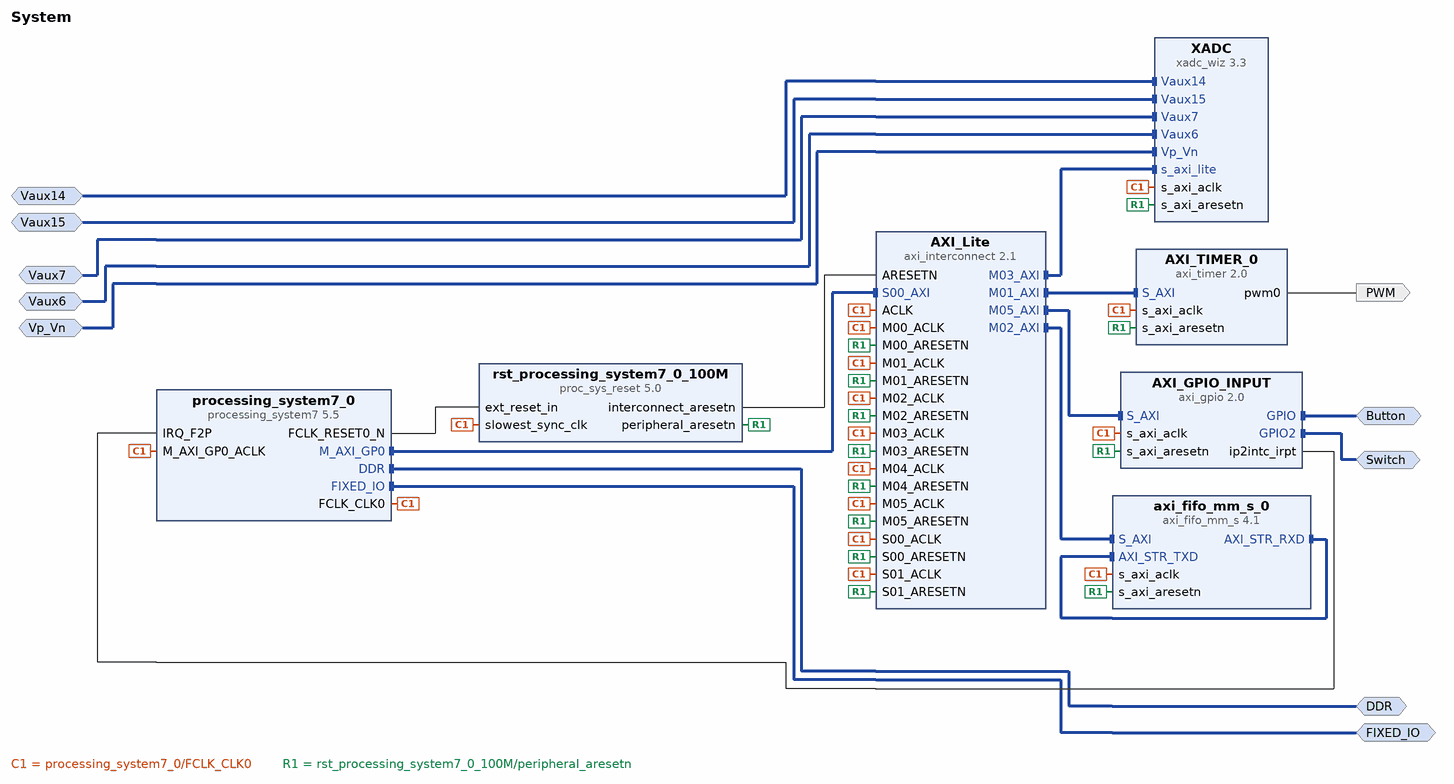
[diagram p0: block diagram of the top level]
# Vivado block design System, Vivado 2016.2
create_bd_design System

create_bd_intf_port -mode Master -vlnv xilinx.com:interface:ddrx_rtl:1.0 DDR
create_bd_intf_port -mode Master -vlnv xilinx.com:display_processing_system7:fixedio_rtl:1.0 FIXED_IO
create_bd_intf_port -mode Slave -vlnv xilinx.com:interface:diff_analog_io_rtl:1.0 Vaux14
create_bd_intf_port -mode Master -vlnv xilinx.com:interface:gpio_rtl:1.0 Button
create_bd_intf_port -mode Slave -vlnv xilinx.com:interface:diff_analog_io_rtl:1.0 Vaux15
create_bd_intf_port -mode Slave -vlnv xilinx.com:interface:diff_analog_io_rtl:1.0 Vaux7
create_bd_intf_port -mode Slave -vlnv xilinx.com:interface:diff_analog_io_rtl:1.0 Vaux6
create_bd_intf_port -mode Master -vlnv xilinx.com:interface:gpio_rtl:1.0 Switch
create_bd_intf_port -mode Slave -vlnv xilinx.com:interface:diff_analog_io_rtl:1.0 Vp_Vn
create_bd_port -dir O PWM

create_bd_cell -type ip -vlnv xilinx.com:ip:processing_system7:5.5 processing_system7_0
set_property -dict [list \
  CONFIG.PCW_UIPARAM_DDR_FREQ_MHZ 525 \
  CONFIG.PCW_CRYSTAL_PERIPHERAL_FREQMHZ 50.000000 \
  CONFIG.PCW_APU_PERIPHERAL_FREQMHZ 650 \
  CONFIG.PCW_SDIO_PERIPHERAL_FREQMHZ 50 \
  CONFIG.PCW_FPGA0_PERIPHERAL_FREQMHZ 100 \
  CONFIG.PCW_USE_FABRIC_INTERRUPT 1 \
  CONFIG.PCW_IRQ_F2P_INTR 1 \
  CONFIG.PCW_IMPORT_BOARD_PRESET /home/daniel/Dropbox/Hobby/Zybo_Xilinx_Xilibus/Zybo/Zybo.xml \
  CONFIG.PCW_PRESET_BANK1_VOLTAGE {LVCMOS 1.8V} \
  CONFIG.PCW_UIPARAM_DDR_PARTNO {MT41K128M16 JT-125} \
  CONFIG.PCW_QSPI_PERIPHERAL_ENABLE 1 \
  CONFIG.PCW_QSPI_GRP_SINGLE_SS_ENABLE 1 \
  CONFIG.PCW_QSPI_GRP_FBCLK_ENABLE 1 \
  CONFIG.PCW_ENET0_PERIPHERAL_ENABLE 1 \
  CONFIG.PCW_ENET0_ENET0_IO {MIO 16 .. 27} \
  CONFIG.PCW_ENET0_GRP_MDIO_ENABLE 1 \
  CONFIG.PCW_SD0_PERIPHERAL_ENABLE 1 \
  CONFIG.PCW_SD0_GRP_CD_ENABLE 1 \
  CONFIG.PCW_SD0_GRP_CD_IO {MIO 47} \
  CONFIG.PCW_SD0_GRP_WP_ENABLE 1 \
  CONFIG.PCW_UART1_PERIPHERAL_ENABLE 1 \
  CONFIG.PCW_TTC0_PERIPHERAL_ENABLE 1 \
  CONFIG.PCW_TTC1_PERIPHERAL_ENABLE 1 \
  CONFIG.PCW_USB0_PERIPHERAL_ENABLE 1 \
  CONFIG.PCW_GPIO_MIO_GPIO_ENABLE 1 \
] [get_bd_cells processing_system7_0]
# 105 more settings of processing_system7_0 are not shown: defaults, MIO pin electricals, DDR timing, and values the tool derives
create_bd_cell -type ip -vlnv xilinx.com:ip:proc_sys_reset:5.0 rst_processing_system7_0_100M
create_bd_cell -type ip -vlnv xilinx.com:ip:axi_fifo_mm_s:4.1 axi_fifo_mm_s_0
create_bd_cell -type ip -vlnv xilinx.com:ip:axi_interconnect:2.1 AXI_Lite
set_property -dict {CONFIG.NUM_SI 2 CONFIG.NUM_MI 6} [get_bd_cells AXI_Lite]
create_bd_cell -type ip -vlnv xilinx.com:ip:xadc_wiz:3.3 XADC
set_property -dict [list \
  CONFIG.XADC_STARUP_SELECTION channel_sequencer \
  CONFIG.SEQUENCER_MODE Continuous \
  CONFIG.SINGLE_CHANNEL_SELECTION TEMPERATURE \
  CONFIG.EXTERNAL_MUX_CHANNEL VP_VN \
  CONFIG.CHANNEL_ENABLE_CALIBRATION true \
  CONFIG.CHANNEL_ENABLE_TEMPERATURE true \
  CONFIG.CHANNEL_ENABLE_VP_VN true \
  CONFIG.CHANNEL_ENABLE_VREFP true \
  CONFIG.CHANNEL_ENABLE_VREFN true \
  CONFIG.CHANNEL_ENABLE_VAUXP6_VAUXN6 true \
  CONFIG.CHANNEL_ENABLE_VAUXP7_VAUXN7 true \
  CONFIG.CHANNEL_ENABLE_VAUXP14_VAUXN14 true \
  CONFIG.CHANNEL_ENABLE_VAUXP15_VAUXN15 true \
  CONFIG.AVERAGE_ENABLE_VP_VN true \
  CONFIG.AVERAGE_ENABLE_VAUXP6_VAUXN6 true \
  CONFIG.AVERAGE_ENABLE_VAUXP7_VAUXN7 true \
  CONFIG.AVERAGE_ENABLE_VAUXP14_VAUXN14 true \
  CONFIG.AVERAGE_ENABLE_VAUXP15_VAUXN15 true \
  CONFIG.AVERAGE_ENABLE_TEMPERATURE true \
  CONFIG.BIPOLAR_VP_VN true \
  CONFIG.BIPOLAR_VAUXP6_VAUXN6 true \
  CONFIG.BIPOLAR_VAUXP7_VAUXN7 true \
  CONFIG.BIPOLAR_VAUXP14_VAUXN14 true \
  CONFIG.BIPOLAR_VAUXP15_VAUXN15 true \
  CONFIG.ACQUISITION_TIME_VP_VN true \
  CONFIG.ACQUISITION_TIME_VAUXP6_VAUXN6 true \
  CONFIG.ACQUISITION_TIME_VAUXP7_VAUXN7 true \
  CONFIG.ACQUISITION_TIME_VAUXP14_VAUXN14 true \
  CONFIG.ACQUISITION_TIME_VAUXP15_VAUXN15 true \
] [get_bd_cells XADC]
create_bd_cell -type ip -vlnv xilinx.com:ip:axi_gpio:2.0 AXI_GPIO_INPUT
set_property -dict [list \
  CONFIG.C_GPIO_WIDTH 4 \
  CONFIG.C_GPIO2_WIDTH 4 \
  CONFIG.C_IS_DUAL 1 \
  CONFIG.C_ALL_INPUTS 1 \
  CONFIG.C_ALL_INPUTS_2 1 \
  CONFIG.C_INTERRUPT_PRESENT 1 \
] [get_bd_cells AXI_GPIO_INPUT]
create_bd_cell -type ip -vlnv xilinx.com:ip:axi_timer:2.0 AXI_TIMER_0
set_property -dict {CONFIG.COUNT_WIDTH 16 CONFIG.enable_timer2 1} [get_bd_cells AXI_TIMER_0]

# ---- connections ----

connect_bd_intf_net [get_bd_intf_pins processing_system7_0/M_AXI_GP0] [get_bd_intf_pins AXI_Lite/S00_AXI]
connect_bd_intf_net [get_bd_intf_pins AXI_Lite/M02_AXI] [get_bd_intf_pins axi_fifo_mm_s_0/S_AXI]
connect_bd_intf_net [get_bd_intf_pins axi_fifo_mm_s_0/AXI_STR_RXD] [get_bd_intf_pins axi_fifo_mm_s_0/AXI_STR_TXD]
connect_bd_intf_net [get_bd_intf_pins AXI_Lite/M03_AXI] [get_bd_intf_pins XADC/s_axi_lite]
connect_bd_intf_net [get_bd_intf_pins AXI_Lite/M05_AXI] [get_bd_intf_pins AXI_GPIO_INPUT/S_AXI]
connect_bd_intf_net [get_bd_intf_pins AXI_Lite/M01_AXI] [get_bd_intf_pins AXI_TIMER_0/S_AXI]
connect_bd_intf_net [get_bd_intf_ports DDR] [get_bd_intf_pins processing_system7_0/DDR]
connect_bd_intf_net [get_bd_intf_ports FIXED_IO] [get_bd_intf_pins processing_system7_0/FIXED_IO]
connect_bd_intf_net -intf_net Vaux14_1 [get_bd_intf_ports Vaux14] [get_bd_intf_pins XADC/Vaux14]
connect_bd_intf_net -intf_net AXI_GPIO_BUTTONS_GPIO [get_bd_intf_ports Button] [get_bd_intf_pins AXI_GPIO_INPUT/GPIO]
connect_bd_intf_net -intf_net Vaux15_1 [get_bd_intf_ports Vaux15] [get_bd_intf_pins XADC/Vaux15]
connect_bd_intf_net -intf_net Vaux7_1 [get_bd_intf_ports Vaux7] [get_bd_intf_pins XADC/Vaux7]
connect_bd_intf_net -intf_net Vaux6_1 [get_bd_intf_ports Vaux6] [get_bd_intf_pins XADC/Vaux6]
connect_bd_intf_net [get_bd_intf_ports Switch] [get_bd_intf_pins AXI_GPIO_INPUT/GPIO2]
connect_bd_intf_net [get_bd_intf_ports Vp_Vn] [get_bd_intf_pins XADC/Vp_Vn]
connect_bd_net [get_bd_pins processing_system7_0/FCLK_CLK0] \
  [get_bd_pins processing_system7_0/M_AXI_GP0_ACLK] [get_bd_pins rst_processing_system7_0_100M/slowest_sync_clk] \
  [get_bd_pins axi_fifo_mm_s_0/s_axi_aclk] [get_bd_pins XADC/s_axi_aclk] [get_bd_pins AXI_GPIO_INPUT/s_axi_aclk] \
  [get_bd_pins AXI_TIMER_0/s_axi_aclk] [get_bd_pins AXI_Lite/ACLK] [get_bd_pins AXI_Lite/S00_ACLK] \
  [get_bd_pins AXI_Lite/M00_ACLK] [get_bd_pins AXI_Lite/M01_ACLK] [get_bd_pins AXI_Lite/S01_ACLK] \
  [get_bd_pins AXI_Lite/M02_ACLK] [get_bd_pins AXI_Lite/M03_ACLK] [get_bd_pins AXI_Lite/M04_ACLK] \
  [get_bd_pins AXI_Lite/M05_ACLK]
connect_bd_net [get_bd_pins processing_system7_0/FCLK_RESET0_N] [get_bd_pins rst_processing_system7_0_100M/ext_reset_in]
connect_bd_net [get_bd_pins rst_processing_system7_0_100M/peripheral_aresetn] \
  [get_bd_pins axi_fifo_mm_s_0/s_axi_aresetn] [get_bd_pins XADC/s_axi_aresetn] [get_bd_pins AXI_GPIO_INPUT/s_axi_aresetn] \
  [get_bd_pins AXI_TIMER_0/s_axi_aresetn] [get_bd_pins AXI_Lite/S00_ARESETN] [get_bd_pins AXI_Lite/M00_ARESETN] \
  [get_bd_pins AXI_Lite/M01_ARESETN] [get_bd_pins AXI_Lite/S01_ARESETN] [get_bd_pins AXI_Lite/M02_ARESETN] \
  [get_bd_pins AXI_Lite/M03_ARESETN] [get_bd_pins AXI_Lite/M04_ARESETN] [get_bd_pins AXI_Lite/M05_ARESETN]
connect_bd_net [get_bd_pins rst_processing_system7_0_100M/interconnect_aresetn] [get_bd_pins AXI_Lite/ARESETN]
connect_bd_net [get_bd_pins AXI_TIMER_0/pwm0] [get_bd_ports PWM]
connect_bd_net [get_bd_pins AXI_GPIO_INPUT/ip2intc_irpt] [get_bd_pins processing_system7_0/IRQ_F2P]

# ---- address map ----
assign_bd_address -offset 0x41210000 -range 64K -target_address_space [get_bd_addr_spaces processing_system7_0/Data] [get_bd_addr_segs AXI_GPIO_INPUT/S_AXI/Reg]
assign_bd_address -offset 0x42800000 -range 64K -target_address_space [get_bd_addr_spaces processing_system7_0/Data] [get_bd_addr_segs AXI_TIMER_0/S_AXI/Reg]
assign_bd_address -offset 0x43C10000 -range 64K -target_address_space [get_bd_addr_spaces processing_system7_0/Data] [get_bd_addr_segs axi_fifo_mm_s_0/S_AXI/Mem0]
assign_bd_address -offset 0x43C20000 -range 64K -target_address_space [get_bd_addr_spaces processing_system7_0/Data] [get_bd_addr_segs XADC/s_axi_lite/Reg]

validate_bd_design
save_bd_design
